# Altium schematic sheet Sensors.SchDoc: Sensor sheet
size A; DrawnBy: Sindre Hovland; Organization: Advanced Wearables Nordic Semi; Revision: V1; SheetNumber: 2; SheetTotal: 4
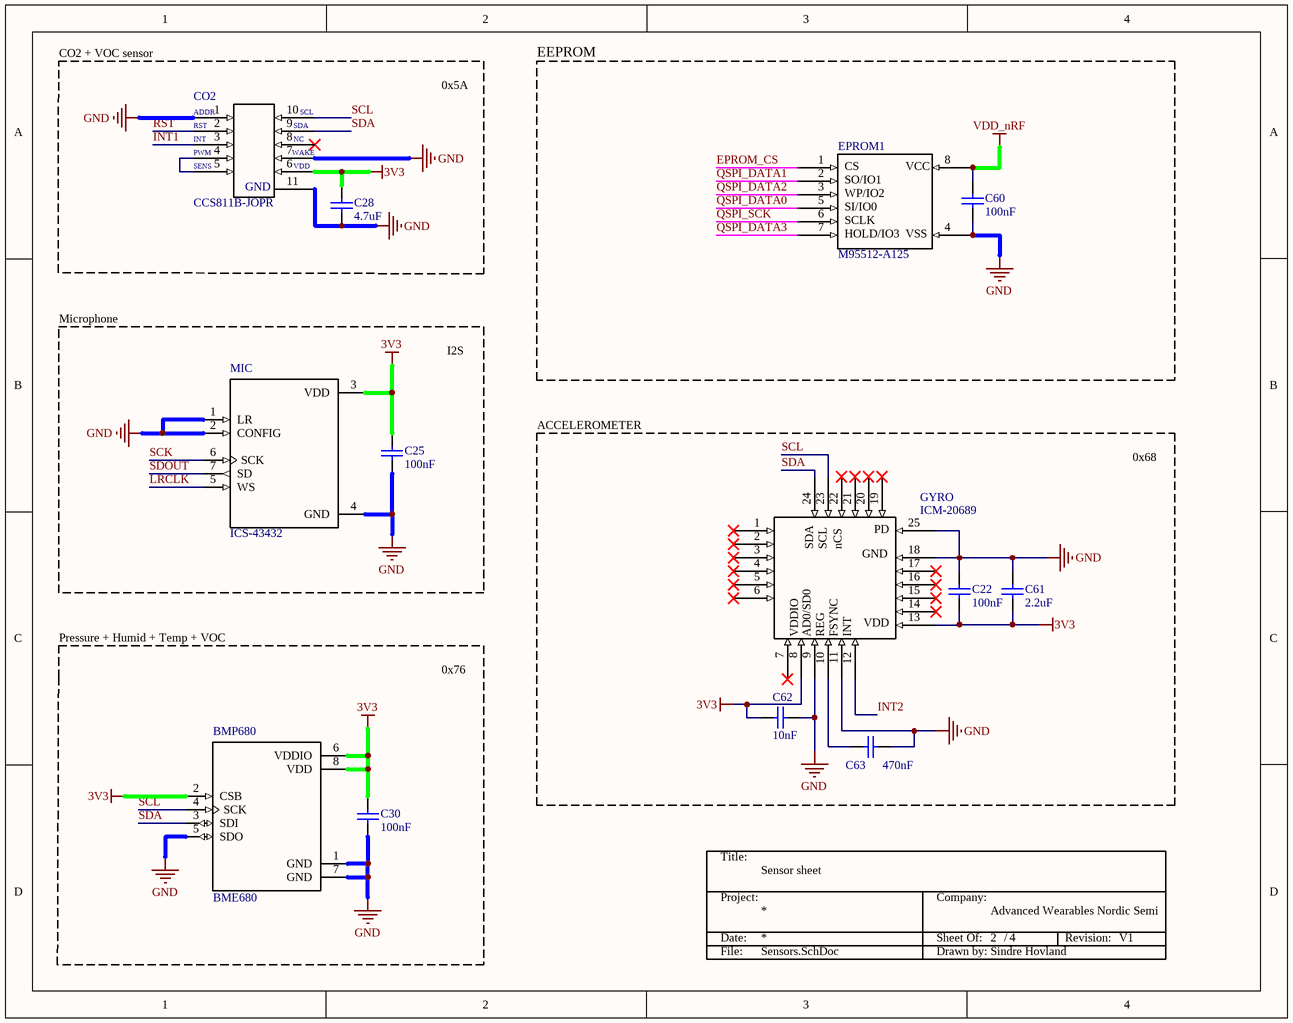
[diagram p0: Sensors.SchDoc]

## Parts
*  TitleBlock  (value not drawn)  (graphical)
BMP680  BME680  [bme680 ic]
C22  100nF  [C0402]
C25  100nF  [C0402]
C28  4.7uF  [C0402]
C30  100nF  [C0402]
C60  100nF  [C0402]
C61  2.2uF  [C0402]
C62  10nF  [C0402]
C63  470nF  [C0402]
CO2  CCS811B-JOPR  [ccs811]
EPROM1  M95512-A125  [M95512-A125]
GYRO  ICM-20689  [QFN50P400X400X90_HS-25N]
MIC  ICS-43432  [MIC_ICS-43432]

## Blocks framed on the sheet
EEPROM: C60 EPROM1

## Nets
3V3: BMP680.2(CSB) BMP680.6(VDDIO) BMP680.8(VDD) C22.1 C25.2 C28.2 C30.1 C61.1 C62.2 CO2.6 GYRO.8 GYRO.13 MIC.3(VDD)
GND: BMP680.1(GND) BMP680.5(SDO) BMP680.7(GND) C22.2 C25.1 C28.1 C30.2 C60.1 C61.2 C62.1 C63.2 CO2.1 CO2.7 CO2.11 EPROM1.4 GYRO.9 GYRO.11 GYRO.18 GYRO.25 MIC.1(LR) MIC.2(CONFIG) MIC.4(GND)
VDD_nRF: C60.2 EPROM1.8
EPROM_CS: EPROM1.1
INT1: CO2.3
INT2: GYRO.12
LRCLK: MIC.5(WS)
QSPI_DATA0: EPROM1.5
QSPI_DATA1: EPROM1.2
QSPI_DATA2: EPROM1.3
QSPI_DATA3: EPROM1.7
QSPI_SCK: EPROM1.6
RST: CO2.2
SCK: MIC.6(SCK)
SCL: BMP680.4(SCK) CO2.10 GYRO.23
SDA: BMP680.3(SDI) CO2.9 GYRO.24
SDOUT: MIC.7(SD)
NetC63_1: C63.1 GYRO.10
NetCO2_4: CO2.4 CO2.5

Not connected (* = marked no-connect by the designer): CO2 8*; GYRO 1* 2* 3* 4* 5* 6* 7* 14* 15* 16* 17* 19* 20* 21* 22*

## Notes on the sheet
- CO2 + VOC sensor
- 0x5A
- Microphone
- I2S
- ACCELEROMETER
- 0x68
- Pressure + Humid + Temp + VOC
- 0x76
- (in symbol CCS811) ADDR; SCL; RST; SDA; INT; NC; PWM; WAKE; SENS; VDD; GND
- (in symbol Flash SPI) CS; VCC; SO/IO1; WP/IO2; SI/IO0; SCLK; HOLD/IO3; VSS
- (in symbol ICM-20689) PD; SDA; SCL; nCS; GND; VDD; VDDIO; AD0/SD0; REG; FSYNC; INT
- (in symbol TitleBlock) Title:; Project:; Company:; Date:; Sheet Of:; /; Revision:; File:; Drawn by:

## Library data of the parts
BMP680 = BME680: / Gas, Humidity, Pressure, Temperature Sensor IÂ²C, SPI Output /; MF: Bosch Sensortec; Digi-Key_Purchase_URL: https://www.digikey.com/product-detail/en/bosch-sensortec/BME680/828-1077-1-ND/7401321?utm_source=snapeda&utm_medium=aggregator&utm_campaign=symbol; SnapEDA_Link: https://www.snapeda.com/parts/BME680/Bosch%20Sensortec/view-part/947201/?ref=snap; MP: BME680; Digi-Key_Part_Number: 828-1077-1-ND; Package: LGA-8 Bosch Tools; Value: *; ComponentLink1Description: Datasheet; ComponentLink1URL: https://www.bosch-sensortec.com/products/environmental-sensors/gas-sensors-bme680/; Supplier 1: Digi-Key; Supplier Part Number 1: 828-1077-1-ND
C22 C25 C28 C30 C60-C63 = CAP: Capacitor; Value: 100pF; Published: 8-Jun-2000; Revision: July-2002: Re-released for DXP Platform.; Publisher: Altium Limited
CO2 = CCS811: CO2 and VOC sensor; ComponentLink1Description: Datasheet; ComponentLink1URL: https://ams.com/ccs811; Manufacturer Part Number: CCS811; Supplier 1: Digi-Key; Supplier Part Number 1: CCS811B-JOPR5KCT-ND
EPROM1 = Flash SPI: EPROM M95512-A125 512K; Supplier 1: Mouser; Supplier Part Number 1: 363-GD25Q16CEIGR
GYRO = ICM-20689: ICM-20689 6 aksis gyro
MIC = ICS-43432: / 50Hz ~ 20kHz Digital, IÂ²S Microphone MEMS _Silicon_ 1.62V ~ 3.63V Omnidirectional _-26dB Â±1dB @ 94dB SPL_ Solder Pads /; MF: TDK InvenSense; SnapEDA_Link: https://www.snapeda.com/parts/ICS-43432/TDK%20InvenSense/view-part/63105/?ref=snap; Price: None; MP: ICS-43432; Package: LGA-7 TDK-InvenSense; Availability: Unavailable; Value: *; Supplier 1: Digi-Key; Supplier Part Number 1: 1428-1053-1-ND